# Altium project PCB_Project.PrjPcb
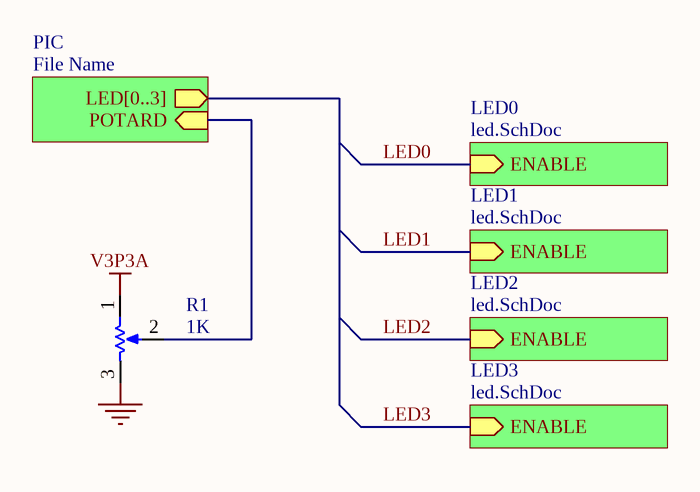
[diagram p0: Sheet1.SchDoc]
1 sheet, 1 parts. Net scope: hierarchical (ports join the sheet entries above them; power ports are global).

## Sheet Sheet1.SchDoc
size A

### Parts
R1  1K  [VR5]

### Sub-sheets
LED0 = led.SchDoc (file not in this document): ENABLE (in)
LED1 = led.SchDoc (file not in this document): ENABLE (in)
LED2 = led.SchDoc (file not in this document): ENABLE (in)
LED3 = led.SchDoc (file not in this document): ENABLE (in)
PIC = File Name (file not in this document): LED[0..3] (out), POTARD (in)

### Nets
GND: R1.3(BOT)
V3P3A: R1.1(TOP)
LED0: sheet LED0/ENABLE
LED1: sheet LED1/ENABLE
LED2: sheet LED2/ENABLE
LED3: sheet LED3/ENABLE
NetR1_2: R1.2(TAP) ; sheet PIC/POTARD

### Library data of the parts
R1 = RPot: Potentiometer; Sim Note: Enter the Resistance value and the set point into parameter fields.; Set Position: 0.5; Published: 8-Jun-2000; LatestRevisionDate: 17-Jul-2002; LatestRevisionNote: Re-released for DXP Platform.; PackageReference: VR5; Publisher: Altium Limited; PackageDescription: Variable Resistor, Thru-Hole; 3 Leads; Value: 1K